# Altium project scalar_network_analyzer.PrjPcb
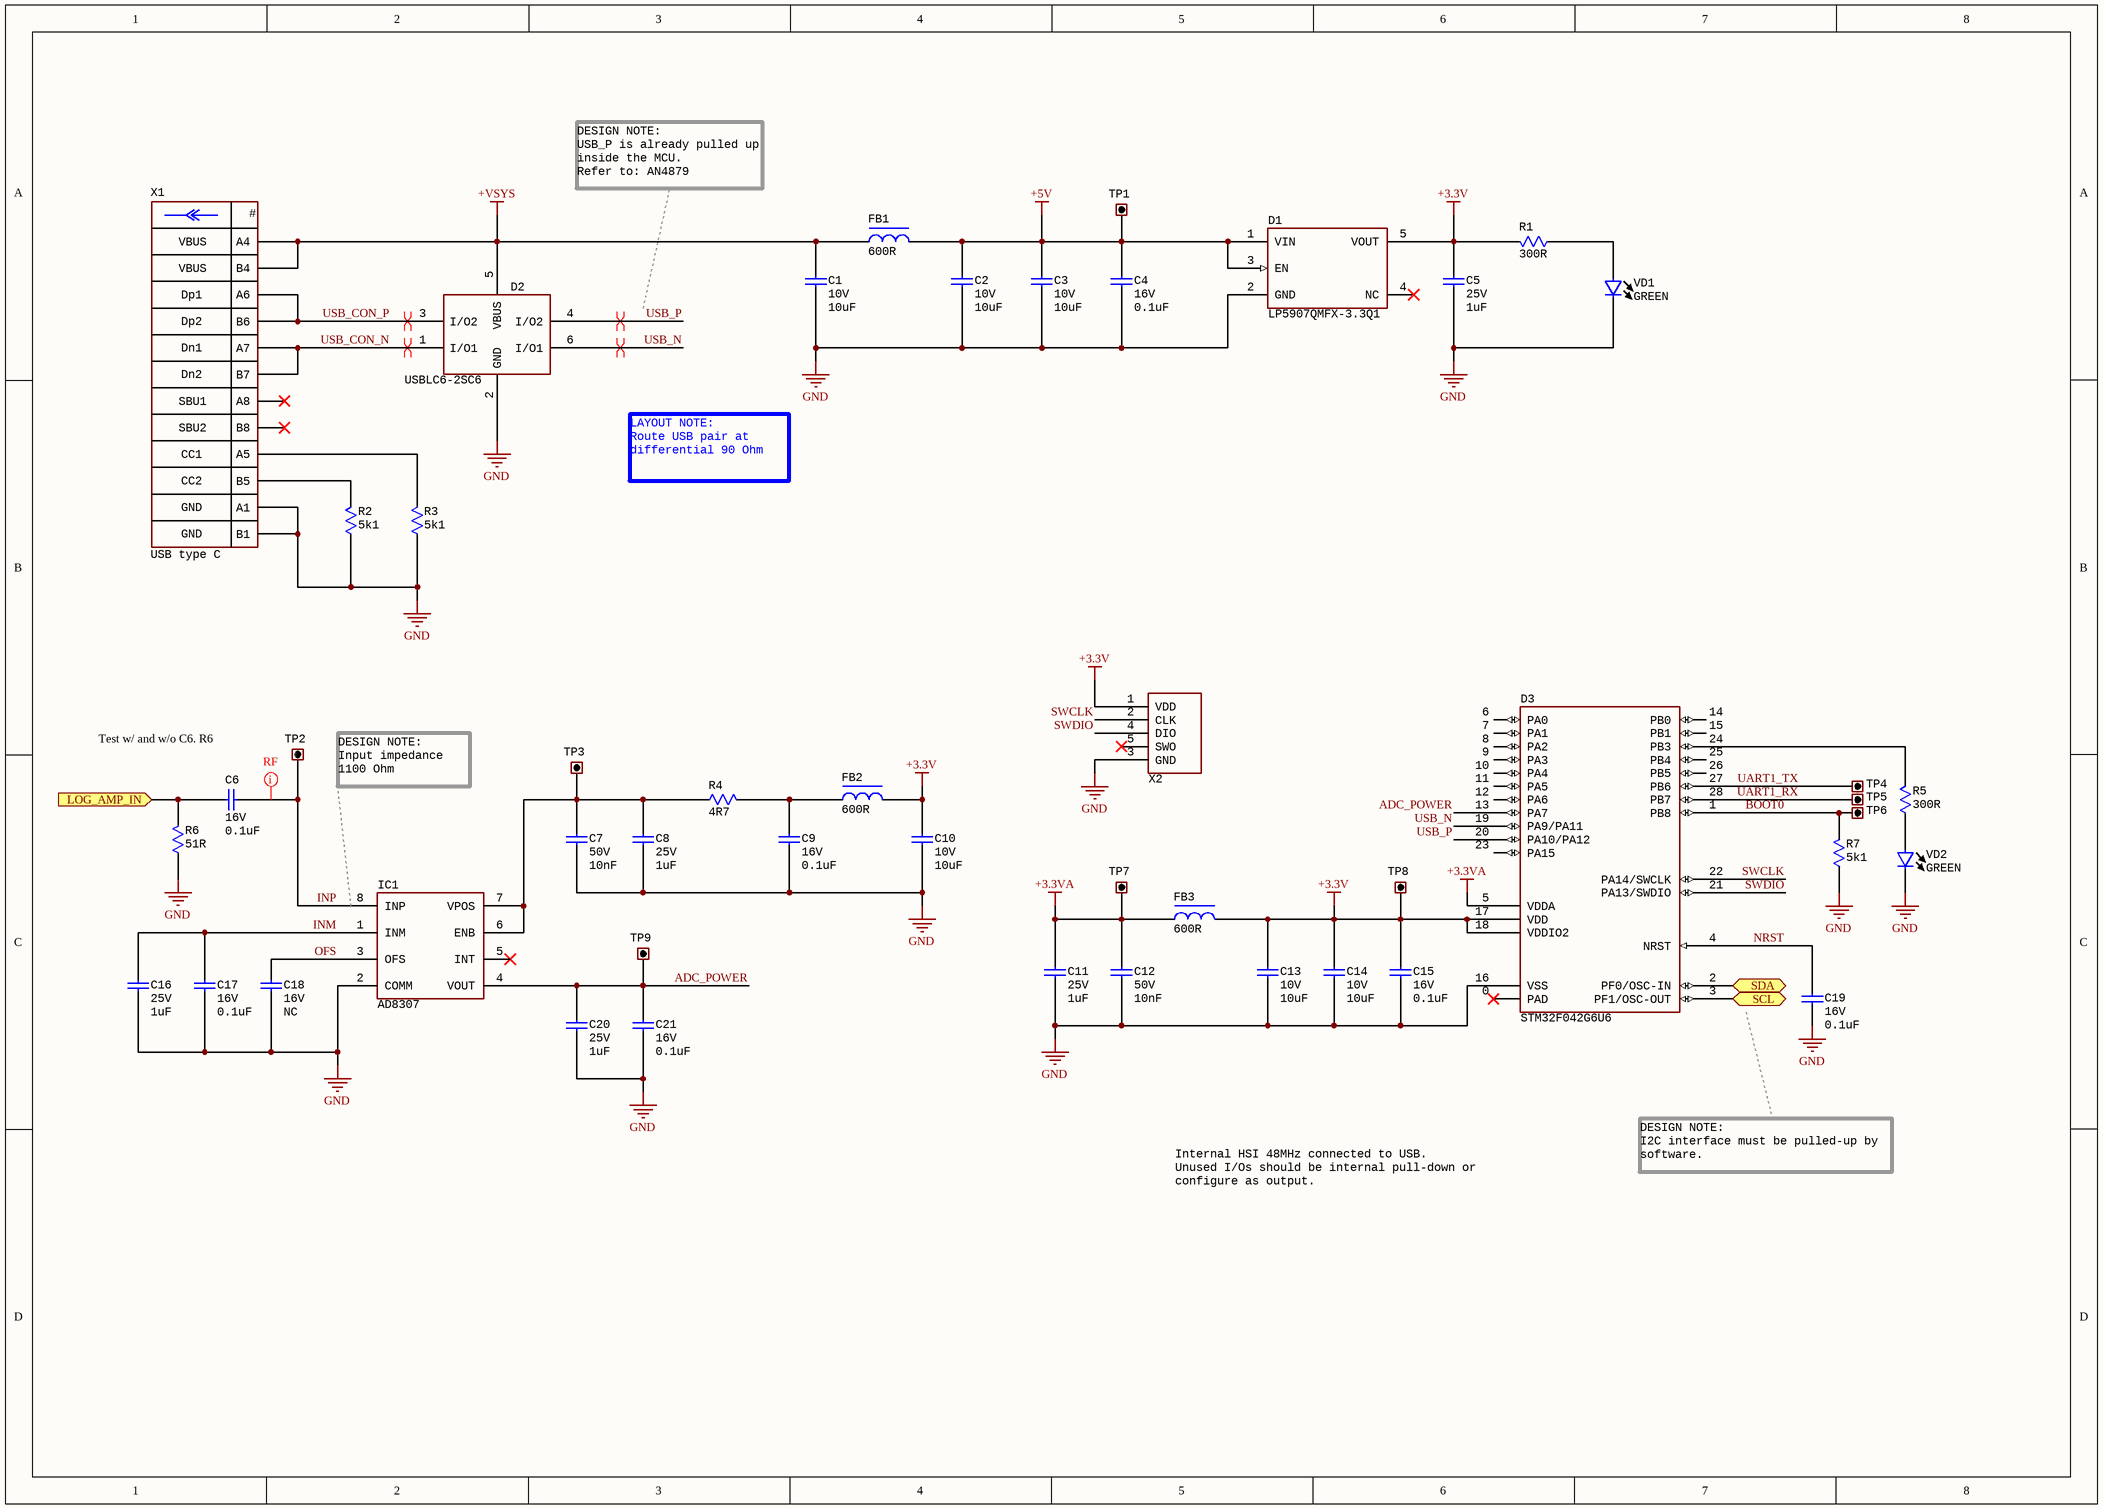
[diagram p0: 01_digital_back_end.SchDoc]
2 sheets, 93 parts. Net scope: flat (ports and power ports of the same name join across sheets).
Board file: sna_pcb.PcbDoc
Sheets:
  01_digital_back_end.SchDoc
  02_rf_front_end.SchDoc

## Sheet 01_digital_back_end.SchDoc
size A3; SheetNumber: 1; SheetTotal: 2

### Parts
C1  value 10uF  Voltage: 10V  [CAP: 0603]
C2  value 10uF  Voltage: 10V  [CAP: 0603]
C3  value 10uF  Voltage: 10V  [CAP: 0603]
C4  value 0.1uF  Voltage: 16V  [CAP: 0402]
C5  value 1uF  Voltage: 25V  [CAP: 0402]
C6  value 0.1uF  Voltage: 16V  [CAP: 0402]
C7  value 10nF  Voltage: 50V  [CAP: 0402]
C8  value 1uF  Voltage: 25V  [CAP: 0402]
C9  value 0.1uF  Voltage: 16V  [CAP: 0402]
C10  value 10uF  Voltage: 10V  [CAP: 0603]
C11  value 1uF  Voltage: 25V  [CAP: 0402]
C12  value 10nF  Voltage: 50V  [CAP: 0402]
C13  value 10uF  Voltage: 10V  [CAP: 0603]
C14  value 10uF  Voltage: 10V  [CAP: 0603]
C15  value 0.1uF  Voltage: 16V  [CAP: 0402]
C16  value 1uF  Voltage: 25V  [CAP: 0402]
C17  value 0.1uF  Voltage: 16V  [CAP: 0402]
C18  value NC  Voltage: 16V  [CAP: 0402]  (no BOM)
C19  value 0.1uF  Voltage: 16V  [CAP: 0402]
C20  value 1uF  Voltage: 25V  [CAP: 0402]
C21  value 0.1uF  Voltage: 16V  [CAP: 0402]
D1  LP5907QMFX-3.3Q1  [SOT23-5]
D2  (no value)  [SOT23-6]
D3  STM32F042G6U6  [28-QFN (4x4)]
FB1  Resistance: 600R  [IND: 0603]
FB2  Resistance: 600R  [IND: 0603]
FB3  Resistance: 600R  [IND: 0603]
IC1  AD8307  [8-SOIC]
R1  value 300R  [RES: 0603]
R2  value 5k1  [RES: 0603]
R3  value 5k1  [RES: 0603]
R4  value 4R7  [RES: 0603]
R5  value 300R  [RES: 0603]
R6  value 51R  [RES: 0603]
R7  value 5k1  [RES: 0603]
TP1  (no value)  [CON: test_point]  (no BOM)
TP2  (no value)  [CON: test_point]  (no BOM)
TP3  (no value)  [CON: test_point]  (no BOM)
TP4  (no value)  [CON: test_point]  (no BOM)
TP5  (no value)  [CON: test_point]  (no BOM)
TP6  (no value)  [CON: test_point]  (no BOM)
TP7  (no value)  [CON: test_point]  (no BOM)
TP8  (no value)  [CON: test_point]  (no BOM)
TP9  (no value)  [CON: test_point]  (no BOM)
VD1  Color: GREEN  [LED: 0603B]
VD2  Color: GREEN  [LED: 0603B]
X1  CommentText: USB type C  [CON: TYPE-C-31-M-12]
X2  (no value)  [CON: 1.27 Pogo Pin contact]  (no BOM)

### Ports
LOG_AMP_IN (in, see 02_rf_front_end[7B]), SCL (bidir, see 02_rf_front_end[5C]), SDA (bidir, see 02_rf_front_end[5C])

### Nets
+3.3V: C5.1 C10.1 C13.1 C14.1 C15.1 D1.5(VOUT) D3.17(VDD) D3.18(VDDIO2) FB2.1 FB3.1 R1.2 TP8.1 X2.1(VDD)
+3.3VA: C11.1 C12.1 D3.5(VDDA) FB3.2 TP7.1
+5V: C2.1 C3.1 C4.1 D1.1(VIN) D1.3(EN) FB1.1 TP1.1
+VSYS: C1.1 D2.5(VBUS) FB1.2 X1.A4 X1.B4
GND: C1.2 C2.2 C3.2 C4.2 C5.2 C7.2 C8.2 C9.2 C10.2 C11.2 C12.2 C13.2 C14.2 C15.2 C16.2 C17.2 C18.2 C19.2 C20.2 C21.2 D1.2(GND) D2.2(GND) D3.16(VSS) IC1.2(COMM) R2.1 R3.1 R6.1 R7.1 VD1.2 VD2.2 X1.A1 X1.B1 X2.3(GND)
ADC_POWER: C20.1 C21.1 D3.13(PA7) IC1.4(VOUT) TP9.1
BOOT0: D3.1(PB8) R7.2 TP6.1
INM: C16.1 C17.1 IC1.1(INM)
INP: C6.2 IC1.8(INP) TP2.1
NRST: C19.1 D3.4(NRST)
OFS: C18.1 IC1.3(OFS)
SWCLK: D3.22(PA14/SWCLK) X2.2(CLK)
SWDIO: D3.21(PA13/SWDIO) X2.4(DIO)
UART1_RX: D3.28(PB7) TP5.1
UART1_TX: D3.27(PB6) TP4.1
USB_CON_N: D2.1(I/O1) X1.A7 X1.B7
USB_CON_P: D2.3(I/O2) X1.A6 X1.B6
USB_N: D2.6(I/O1) D3.19(PA9/PA11)
USB_P: D2.4(I/O2) D3.20(PA10/PA12)
NetC6_1: C6.1 R6.2 ; port LOG_AMP_IN
NetC7_1: C7.1 C8.1 IC1.6(ENB) IC1.7(VPOS) R4.1 TP3.1
NetC9_1: C9.1 FB2.2 R4.2
NetD3_2: D3.2(PF0/OSC-IN) ; port SDA
NetD3_3: D3.3(PF1/OSC-OUT) ; port SCL
NetD3_24: D3.24(PB3) R5.2
NetR1_1: R1.1 VD1.1
NetR2_2: R2.2 X1.B5
NetR3_2: R3.2 X1.A5
NetR5_1: R5.1 VD2.1

Not connected (* = marked no-connect by the designer): D1 4(NC)*; D3 0(PAD)* 6(PA0) 7(PA1) 8(PA2) 9(PA3) 10(PA4) 11(PA5) 12(PA6) 14(PB0) 15(PB1) 23(PA15) 25(PB4) 26(PB5); IC1 5(INT)*; X1 A8* B8*; X2 5(SWO)*

### Layout directives
differential pair: USB_CON_N, USB_CON_P, USB_N, USB_P
net class RF: INP

### Notes on the sheet
- DESIGN NOTE:
  USB_P is already pulled up inside the MCU.
  Refer to: AN4879
- LAYOUT NOTE:
  Route USB pair at differential 90 Ohm
- Test w/ and w/o C6. R6
- (near TP2) DESIGN NOTE:
  Input impedance 1100 Ohm
- DESIGN NOTE:
  I2C interface must be pulled-up by software.
- Internal HSI 48MHz connected to USB.
  Unused I/Os should be internal pull-down or configure as output.
- (in symbol Connector_USB_Type_C) #; VBUS; Dp1; Dp2; Dn1; Dn2; SBU1; SBU2; CC1; CC2; GND

### Library data of the parts
C1-C3 C10 C13 C14 = Ceramic: Manufacturer: Samsung Electro-Mechanics; PartNumber: CL10A106KP8NNNC; ValueManufacturerPartNumber: Ceramic capacitor, 10uF, X5R, ±10%, 10V, 0603, -55...+125°C; TypeCapacitor: Ceramic capacitor; Tolerance: ±10%; TypeDielectric: X5R; Package: 0603; HelpURL: https://jlcpcb.com/partdetail/20411-CL10A106KP8NNNC/C19702; Temperature: -55...+125°C; JLCPCB Part #: C19702
C4 C6 C9 C15 C17 C19 C21 = Ceramic: Manufacturer: Samsung Electro-Mechanics; PartNumber: CL05B104KO5NNNC; ValueManufacturerPartNumber: Ceramic capacitor, 0.1uF, X7R, ±10%, 16V, 0402, -55...+125°C; TypeCapacitor: Ceramic capacitor; Tolerance: ±10%; TypeDielectric: X7R; Package: 0402; HelpURL: https://jlcpcb.com/partdetail/1877-CL05B104KO5NNNC/C1525; Temperature: -55...+125°C; JLCPCB Part #: C1525
C5 C8 C11 C16 C20 = Ceramic: Manufacturer: Samsung Electro-Mechanics; PartNumber: CL05A105KA5NQNC; ValueManufacturerPartNumber: Ceramic capacitor, 1uF, X5R, ±10%, 25V, 0402, -55...+125°C; TypeCapacitor: Ceramic capacitor; Tolerance: ±10%; TypeDielectric: X5R; Package: 0402; HelpURL: https://jlcpcb.com/partdetail/53938-CL05A105KA5NQNC/C52923; Temperature: -55...+125°C; JLCPCB Part #: C52923
C7 C12 = Ceramic: Manufacturer: Samsung Electro-Mechanics; PartNumber: CL05B103KB5NNNC; ValueManufacturerPartNumber: Ceramic capacitor, 10nF, X7R, ±10%, 50V, 0402, -55...+125°C; TypeCapacitor: Ceramic capacitor; Tolerance: ±10%; TypeDielectric: X7R; Package: 0402; HelpURL: https://jlcpcb.com/partdetail/15869-CL05B103KB5NNNC/C15195; Temperature: -55...+125°C; JLCPCB Part #: C15195
C18 = Ceramic: Manufacturer: Yageo; PartNumber: CC0201KRX7R7BB103; ValueManufacturerPartNumber: Ceramic capacitor, NC, X7R, ±10%, 16V, 0603, -55...+125°C; TypeCapacitor: Ceramic capacitor; Tolerance: ±10%; TypeDielectric: X7R; Package: 0603; HelpURL: https://www.digikey.com/product-detail/en/yageo/CC0201KRX7R7BB103/311-1404-1-ND/2833710; Temperature: -55...+125°C
D1 = LDO: ValueManufacturerPartNumber: LP5907QMFX-3.3Q1; PartNumber: LP5907QMFX-3.3Q1
D2 = USBLC6-2SC6: Manufacturer: STMicroelectronics; TypeDiode: USB protection; Current: 5A peak; VoltageDrop: 17V; RecoveryTime: Power line; Package: SOT-23-6; HelpURL: https://www.digikey.com/product-detail/en/stmicroelectronics/USBLC6-2SC6/497-5235-1-ND/1121688; ValueManufacturerPartNumber: =TypeDiode+', '+Voltage+', '+Current+', '+VoltageDrop+', '+RecoveryTime+', '+Package+', '+Temperature; Temperature: -40...+125°C; PartNumber: USBLC6-2SC6
D3 = STM32F042G6U6: Cortex-M0, 48MHz, 32KB ROM, 6KB RAM, 2.4...3.6V, QFN-28, -40...+85°C; Manufacturer: STMicroelectronics; HelpURL: https://eu.mouser.com/ProductDetail/STMicroelectronics/STM32F042K6U6?qs=4l9S5vBWkUI1HFPPlP09zA%3D%3D; Package: QFN-28; PartNumber: STM32F042G6U6; JLCPCB Part #: C961597
FB1-FB3 = Ferrite_Bead_SMD: Manufacturer: Sunlord; PartNumber: LQP03TNR10J02D; TypeInductor: Ferrite Bead; MaxCurrent: 200mA; Frequency: 100 MHz; Package: 0603; HelpURL: https://www.digikey.com/product-detail/en/murata-electronics-north-america/LQP03TNR10J02D/490-6742-1-ND/3845939; ValueManufacturerPartNumber: =TypeInductor+', '+Value+', '+Tolerance+', '+Package+', '+MaxCurrent+', '+Temperature; Temperature: -55...+125°C; JLCPCB Part #: C1002
IC1 = AD8307: Integrated Circuit; Manufacturer_Name: Analog Devices; Datasheet Link: https://www.arrow.com/en/products/ad8310arm/analog-devices; Height: 1.1mm; Manufacturer_Part_Number: AD8307; Mouser Price/Stock: https://www.mouser.com/Search/Refine.aspx?Keyword=584-AD8310ARM; Arrow Price/Stock: https://www.arrow.com/en/products/ad8310arm/analog-devices
R1 R5 = Resistor: Manufacturer: Yageo; PartNumber: RC0201JR-07100RL; ValueManufacturerPartNumber: Resistor film, 300R, ±5%, 0603, 0.05W, -55...+125°C; TypeResistor: Resistor film; Power: 0.05W; Tolerance: ±5%; Package: 0603; HelpURL: https://www.digikey.com/product-detail/en/yageo/RC0201JR-07100RL/311-100NCT-ND/1949006; Temperature: -55...+125°C; JLCPCB Part #: C23025
R2 R3 = Resistor: Manufacturer: Yageo; PartNumber: 0603WAF5101T5E; ValueManufacturerPartNumber: Resistor film, 5k1, ±5%, 0603, 0.05W, -55...+125°C; TypeResistor: Resistor film; Power: 0.05W; Tolerance: ±5%; Package: 0603; HelpURL: https://lcsc.com/product-detail/Chip-Resistor-Surface-Mount_UNI-ROYAL-Uniroyal-Elec-0603WAF5101T5E_C23186.html; Temperature: -55...+125°C; JLCPCB Part #: C23186
R4 = Resistor: Manufacturer: Yageo; PartNumber: RC0201JR-07100RL; ValueManufacturerPartNumber: Resistor film, 4R7, ±5%, 0603, 0.05W, -55...+125°C; TypeResistor: Resistor film; Power: 0.05W; Tolerance: ±5%; Package: 0603; HelpURL: https://www.digikey.com/product-detail/en/yageo/RC0201JR-07100RL/311-100NCT-ND/1949006; Temperature: -55...+125°C; JLCPCB Part #: C23164
R6 = Resistor: Manufacturer: Yageo; PartNumber: 0603WAF5101T5E; ValueManufacturerPartNumber: Resistor film, 51R, ±5%, 0603, 0.05W, -55...+125°C; TypeResistor: Resistor film; Power: 0.05W; Tolerance: ±5%; Package: 0603; HelpURL: https://lcsc.com/product-detail/Chip-Resistor-Surface-Mount_UNI-ROYAL-Uniroyal-Elec-0603WAF5101T5E_C23186.html; Temperature: -55...+125°C; JLCPCB Part #: C23197
R7 = Resistor: Manufacturer: Yageo; PartNumber: RC0201JR-07100RL; ValueManufacturerPartNumber: Resistor film, 5k1, ±5%, 0603, 0.05W, -55...+125°C; TypeResistor: Resistor film; Power: 0.05W; Tolerance: ±5%; Package: 0603; HelpURL: https://www.digikey.com/product-detail/en/yageo/RC0201JR-07100RL/311-100NCT-ND/1949006; Temperature: -55...+125°C; JLCPCB Part #: C23186
TP1-TP9 = Connector_Test_Point: Manufacturer: Keystone; ValueManufacturerPartNumber: Test point, Keystone, 5001; PartNumber: 5001; TypeConnector: Test point; HelpURL: https://www.digikey.com/product-detail/en/keystone-electronics/5001/36-5001-ND/255327
VD1 VD2 = LED_single: ValueManufacturerPartNumber: LED, Green, *, *, *, -55...+150°C; TypeDiode: LED; Manufacturer: *; Package: *; HelpURL: *; Temperature: -55...+150°C; Current: *; VoltageDrop: *; PartNumber: *; ColorParameter: Green; JLCPCB Part #: C72041
X1 = Connector_USB_Type_C: Manufacturer: Korean Hroparts; ValueManufacturerPartNumber: USB Type C, 3A; PartNumber: TYPE-C-31-M-12; CurrentMax: 3A; HelpURL: https://lcsc.com/product-detail/USB-Type-C_Korean-Hroparts-Elec-TYPE-C-31-M-12_C165948.html; TypeConnector: USB Type C
X2 = Connector SWD: SWD Interface

## Sheet 02_rf_front_end.SchDoc
size A3; SheetNumber: 2; SheetTotal: 2
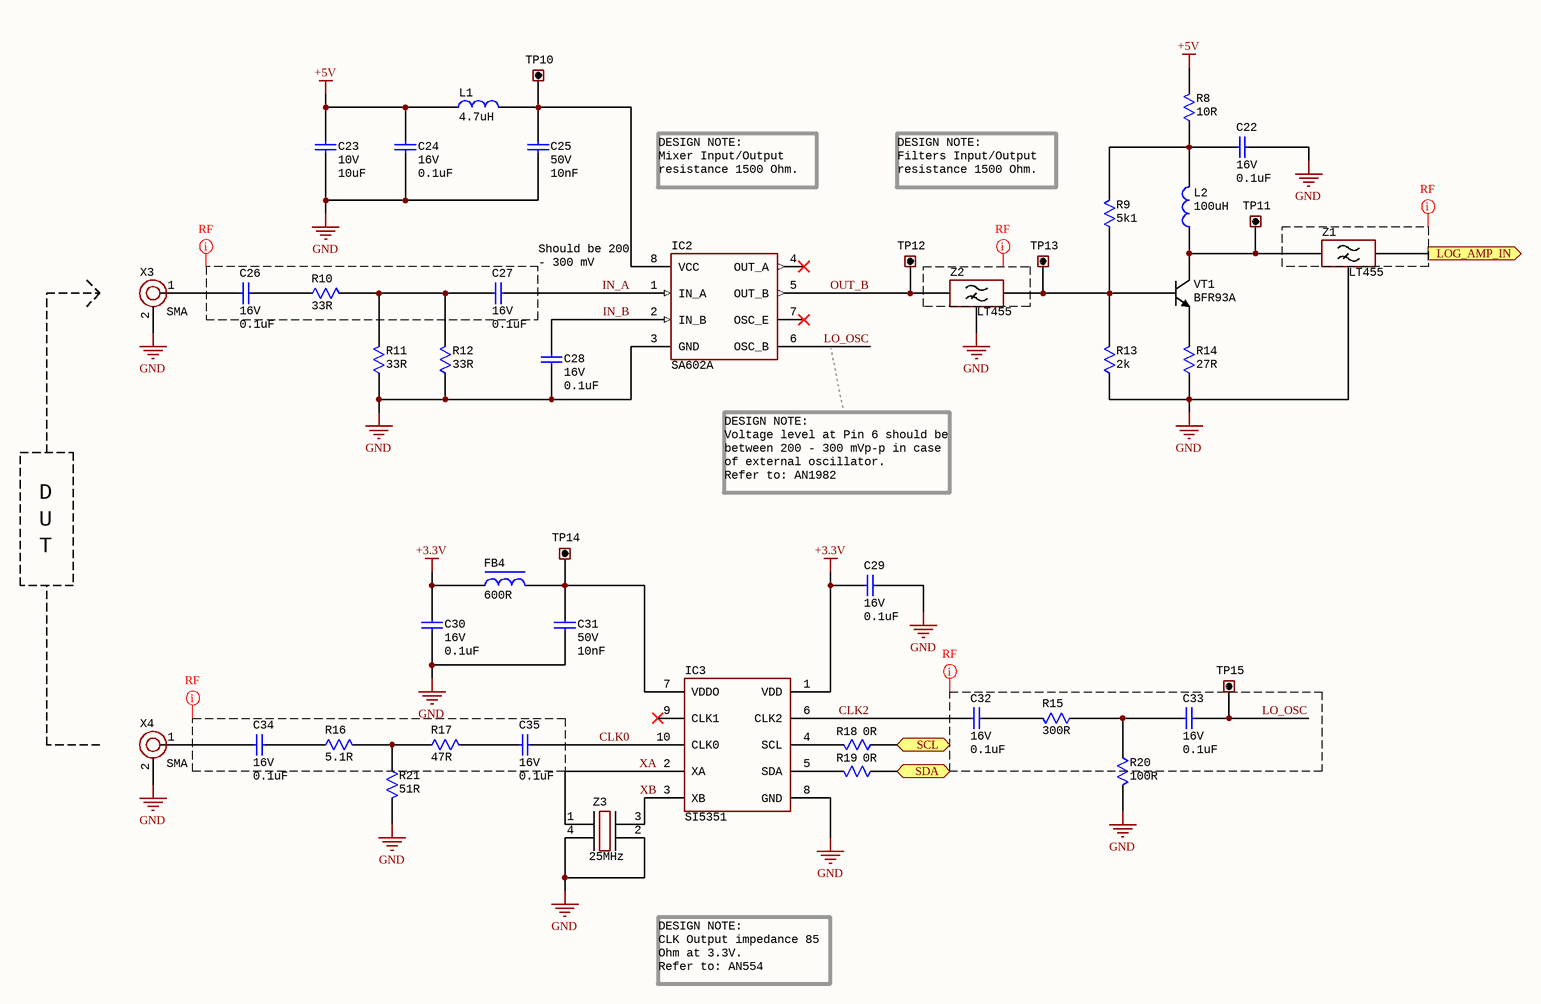
[diagram p1: 02_rf_front_end.SchDoc]

### Parts
C22  value 0.1uF  Voltage: 16V  [CAP: 0402]
C23  value 10uF  Voltage: 10V  [CAP: 0603]
C24  value 0.1uF  Voltage: 16V  [CAP: 0402]
C25  value 10nF  Voltage: 50V  [CAP: 0402]
C26  value 0.1uF  Voltage: 16V  [CAP: 0402]
C27  value 0.1uF  Voltage: 16V  [CAP: 0402]
C28  value 0.1uF  Voltage: 16V  [CAP: 0402]
C29  value 0.1uF  Voltage: 16V  [CAP: 0402]
C30  value 0.1uF  Voltage: 16V  [CAP: 0402]
C31  value 10nF  Voltage: 50V  [CAP: 0402]
C32  value 0.1uF  Voltage: 16V  [CAP: 0402]
C33  value 0.1uF  Voltage: 16V  [CAP: 0402]
C34  value 0.1uF  Voltage: 16V  [CAP: 0402]
C35  value 0.1uF  Voltage: 16V  [CAP: 0402]
FB4  Resistance: 600R  [IND: 0603]
IC2  SA602A  [8-SOIC]
IC3  SI5351  [10-MSOP]
L1  value 4.7uH  [IND: 0603]
L2  value 100uH  [IND: 0805]
R8  value 10R  [RES: 0603]
R9  value 5k1  [RES: 0603]
R10  value 33R  [RES: 0603]
R11  value 33R  [RES: 0603]
R12  value 33R  [RES: 0603]
R13  value 2k  [RES: 0603]
R14  value 27R  [RES: 0603]
R15  value 300R  [RES: 0603]
R16  value 5.1R  [RES: 0603]
R17  value 47R  [RES: 0603]
R18  value 0R  [RES: 0402]  (no BOM)
R19  value 0R  [RES: 0402]  (no BOM)
R20  value 100R  [RES: 0603]
R21  value 51R  [RES: 0603]
TP10  (no value)  [CON: test_point]  (no BOM)
TP11  (no value)  [CON: test_point]  (no BOM)
TP12  (no value)  [CON: test_point]  (no BOM)
TP13  (no value)  [CON: test_point]  (no BOM)
TP14  (no value)  [CON: test_point]  (no BOM)
TP15  (no value)  [CON: test_point]  (no BOM)
VT1  PartNumber: BFR93A  [SOT23]
X3  CommentText: SMA  [CON: SMA EDGE MOUNT]
X4  CommentText: SMA  [CON: SMA EDGE MOUNT]
Z1  (no value)  [CFUKG455]
Z2  (no value)  [CFUKG455]
Z3  Frequency: 25MHz  [OSC: 3225]

### Ports
LOG_AMP_IN (out, see 01_digital_back_end[1C]), SCL (bidir, see 01_digital_back_end[7C]), SDA (bidir, see 01_digital_back_end[7C])

### Nets
+3.3V: C29.1 C30.1 FB4.2 IC3.1(VDD)
+5V: C23.1 C24.1 L1.2 R8.2
GND: C22.2 C23.2 C24.2 C25.2 C28.1 C29.2 C30.2 C31.2 IC2.3(GND) IC3.8(GND) R11.1 R12.1 R13.1 R14.1 R20.1 R21.1 X3.2 X4.2 Z1.3(GND) Z2.3(GND) Z3.2 Z3.4
CLK0: C35.1 IC3.10(CLK0)
CLK2: C32.2 IC3.6(CLK2)
IN_A: C27.2 IC2.1(IN_A)
IN_B: C28.2 IC2.2(IN_B)
LO_OSC: C33.1 IC2.6(OSC_B) TP15.1
OUT_B: IC2.5(OUT_B) TP12.1 Z2.1(IN)
XA: IC3.2(XA) Z3.1
XB: IC3.3(XB) Z3.3
NetC6_1: Z1.2(OUT) ; port LOG_AMP_IN
NetC22_1: C22.1 L2.1 R8.1 R9.2
NetC25_1: C25.1 IC2.8(VCC) L1.1 TP10.1
NetC26_1: C26.1 X3.1
NetC26_2: C26.2 R10.1
NetC27_1: C27.1 R10.2 R11.2 R12.2
NetC31_1: C31.1 FB4.1 IC3.7(VDDO) TP14.1
NetC32_1: C32.1 R15.1
NetC33_2: C33.2 R15.2 R20.2
NetC34_1: C34.1 R16.2
NetC34_2: C34.2 X4.1
NetC35_2: C35.2 R17.1
NetD3_2: R19.1 ; port SDA
NetD3_3: R18.1 ; port SCL
NetIC3_4: IC3.4(SCL) R18.2
NetIC3_5: IC3.5(SDA) R19.2
NetL2_2: L2.2 TP11.1 VT1.3(C) Z1.1(IN)
NetR9_1: R9.1 R13.2 TP13.1 VT1.1(B) Z2.2(OUT)
NetR14_2: R14.2 VT1.2(E)
NetR16_1: R16.1 R17.2 R21.2

Not connected (* = marked no-connect by the designer): IC2 4(OUT_A)* 7(OSC_E)*; IC3 9(CLK1)*

### Layout directives
net class RF: (no net found under the mark), LO_OSC

### Notes on the sheet
- DESIGN NOTE:
  Mixer Input/Output resistance 1500 Ohm.
- DESIGN NOTE:
  Filters Input/Output resistance 1500 Ohm.
- Should be 200 - 300 mV
- D
- U
- DESIGN NOTE:
  Voltage level at Pin 6 should be between 200 - 300 mVp-p in case of external oscillator.
  Refer to: AN1982
- T
- DESIGN NOTE:
  CLK Output impedance 85 Ohm at 3.3V.
  Refer to: AN554

### Library data of the parts
C22 C24 C26-C30 C32-C35 = Ceramic: as C4 on sheet 01_digital_back_end; Package: 0402; HelpURL: https://jlcpcb.com/partdetail/1877-CL05B104KO5NNNC/C1525; Temperature: -55...+125°C; JLCPCB Part #: C1525
C23 = Ceramic: as C1 on sheet 01_digital_back_end; Package: 0603; HelpURL: https://jlcpcb.com/partdetail/20411-CL10A106KP8NNNC/C19702; Temperature: -55...+125°C; JLCPCB Part #: C19702
C25 C31 = Ceramic: as C7 on sheet 01_digital_back_end; Package: 0402; HelpURL: https://jlcpcb.com/partdetail/15869-CL05B103KB5NNNC/C15195; Temperature: -55...+125°C; JLCPCB Part #: C15195
FB4 = Ferrite_Bead_SMD: as FB1 on sheet 01_digital_back_end; Package: 0603; HelpURL: https://www.digikey.com/product-detail/en/murata-electronics-north-america/LQP03TNR10J02D/490-6742-1-ND/3845939; ValueManufacturerPartNumber: =TypeInductor+', '+Value+', '+Tolerance+', '+Package+', '+MaxCurrent+', '+Temperature; Temperature: -55...+125°C; JLCPCB Part #: C1002
IC2 = SA602A: Integrated Circuit; Manufacturer_Name: NXP; Manufacturer_Part_Number: SA602AD/01,118; Datasheet Link: http://www.nxp.com/docs/en/data-sheet/SA602A.pdf; Height: 1.75mm; Mouser Part Number: 771-SA602AD/01-T; Mouser Price/Stock: https://www.mouser.co.uk/ProductDetail/NXP-Semiconductors/SA602AD-01118?qs=LOCUfHb8d9uqq1xhBWuUZQ%3D%3D; Arrow Part Number: SA602AD/01,118; Arrow Price/Stock: https://www.arrow.com/en/products/sa602ad01118/nxp-semiconductors?region=nac
IC3 = Si5351A: Integrated Circuit; Manufacturer_Name: Silicon Labs; Manufacturer_Part_Number: Si5351A-B-GT; Datasheet Link: https://componentsearchengine.com/Datasheets/1/Si5351A-B-GT.pdf; Height: 1.1mm; Mouser Part Number: 634-SI5351A-B-GT; Mouser Price/Stock: https://www.mouser.co.uk/ProductDetail/Silicon-Labs/SI5351A-B-GT?qs=p9T7GgSe1IEO%252BMfC%2FKPFfA%3D%3D; Arrow Part Number: SI5351A-B-GT; Arrow Price/Stock: https://www.arrow.com/en/products/si5351a-b-gt/silicon-labs; JLCPCB Part #: C504891
L1 = Inductor_SMD: Manufacturer: Murata Electronics; PartNumber: LQP03TNR10J02D; ValueManufacturerPartNumber: Fixed inductor, 4.7uH, ±5%, 0201, 80mA, -55...+125°C; TypeInductor: Fixed inductor; MaxCurrent: 80mA; Tolerance: ±5%; Package: 0201; HelpURL: https://www.digikey.com/product-detail/en/murata-electronics-north-america/LQP03TNR10J02D/490-6742-1-ND/3845939; Temperature: -55...+125°C; JLCPCB Part #: C1034
L2 = Inductor_SMD: Manufacturer: Murata Electronics; PartNumber: LQP03TNR10J02D; ValueManufacturerPartNumber: Fixed inductor, 100uH, ±5%, 0201, 80mA, -55...+125°C; TypeInductor: Fixed inductor; MaxCurrent: 80mA; Tolerance: ±5%; Package: 0201; HelpURL: https://www.digikey.com/product-detail/en/murata-electronics-north-america/LQP03TNR10J02D/490-6742-1-ND/3845939; Temperature: -55...+125°C
R8 = Resistor: Manufacturer: Yageo; PartNumber: RC0201JR-07100RL; ValueManufacturerPartNumber: Resistor film, 10R, ±5%, 0603, 0.05W, -55...+125°C; TypeResistor: Resistor film; Power: 0.05W; Tolerance: ±5%; Package: 0603; HelpURL: https://www.digikey.com/product-detail/en/yageo/RC0201JR-07100RL/311-100NCT-ND/1949006; Temperature: -55...+125°C
R9 = Resistor: as R7 on sheet 01_digital_back_end; Package: 0603; HelpURL: https://www.digikey.com/product-detail/en/yageo/RC0201JR-07100RL/311-100NCT-ND/1949006; Temperature: -55...+125°C; JLCPCB Part #: C23186
R10-R12 = Resistor: Manufacturer: Yageo; PartNumber: RC0201JR-07100RL; ValueManufacturerPartNumber: Resistor film, 33R, ±5%, 0603, 0.05W, -55...+125°C; TypeResistor: Resistor film; Power: 0.05W; Tolerance: ±5%; Package: 0603; HelpURL: https://www.digikey.com/product-detail/en/yageo/RC0201JR-07100RL/311-100NCT-ND/1949006; Temperature: -55...+125°C; JLCPCB Part #: C23140
R13 = Resistor: Manufacturer: Yageo; PartNumber: RC0201JR-07100RL; ValueManufacturerPartNumber: Resistor film, 2k, ±5%, 0603, 0.05W, -55...+125°C; TypeResistor: Resistor film; Power: 0.05W; Tolerance: ±5%; Package: 0603; HelpURL: https://www.digikey.com/product-detail/en/yageo/RC0201JR-07100RL/311-100NCT-ND/1949006; Temperature: -55...+125°C; JLCPCB Part #: C22975
R14 = Resistor: Manufacturer: Yageo; PartNumber: RC0201JR-07100RL; ValueManufacturerPartNumber: Resistor film, 27R, ±5%, 0603, 0.05W, -55...+125°C; TypeResistor: Resistor film; Power: 0.05W; Tolerance: ±5%; Package: 0603; HelpURL: https://www.digikey.com/product-detail/en/yageo/RC0201JR-07100RL/311-100NCT-ND/1949006; Temperature: -55...+125°C; JLCPCB Part #: C25190
R15 = Resistor: as R1 on sheet 01_digital_back_end; Package: 0603; HelpURL: https://www.digikey.com/product-detail/en/yageo/RC0201JR-07100RL/311-100NCT-ND/1949006; Temperature: -55...+125°C; JLCPCB Part #: C23025
R16 = Resistor: Manufacturer: Yageo; PartNumber: RC0201JR-07100RL; ValueManufacturerPartNumber: Resistor film, 5.1R, ±5%, 0603, 0.05W, -55...+125°C; TypeResistor: Resistor film; Power: 0.05W; Tolerance: ±5%; Package: 0603; HelpURL: https://www.digikey.com/product-detail/en/yageo/RC0201JR-07100RL/311-100NCT-ND/1949006; Temperature: -55...+125°C; JLCPCB Part #: C25197
R17 = Resistor: Manufacturer: Yageo; PartNumber: RC0201JR-07100RL; ValueManufacturerPartNumber: Resistor film, 47R, ±5%, 0603, 0.05W, -55...+125°C; TypeResistor: Resistor film; Power: 0.05W; Tolerance: ±5%; Package: 0603; HelpURL: https://www.digikey.com/product-detail/en/yageo/RC0201JR-07100RL/311-100NCT-ND/1949006; Temperature: -55...+125°C; JLCPCB Part #: C23182
R18 R19 = Resistor: Manufacturer: Yageo; PartNumber: RC0201JR-07100RL; ValueManufacturerPartNumber: Resistor film, 0R, ±5%, 0603, 0.05W, -55...+125°C; TypeResistor: Resistor film; Power: 0.05W; Tolerance: ±5%; Package: 0603; HelpURL: https://www.digikey.com/product-detail/en/yageo/RC0201JR-07100RL/311-100NCT-ND/1949006; Temperature: -55...+125°C
R20 = Resistor: Manufacturer: Yageo; PartNumber: RC0201JR-07100RL; ValueManufacturerPartNumber: Resistor film, 100R, ±5%, 0603, 0.05W, -55...+125°C; TypeResistor: Resistor film; Power: 0.05W; Tolerance: ±5%; Package: 0603; HelpURL: https://www.digikey.com/product-detail/en/yageo/RC0201JR-07100RL/311-100NCT-ND/1949006; Temperature: -55...+125°C; JLCPCB Part #: C22775
R21 = Resistor: Manufacturer: Yageo; PartNumber: RC0201JR-07100RL; ValueManufacturerPartNumber: Resistor film, 51R, ±5%, 0603, 0.05W, -55...+125°C; TypeResistor: Resistor film; Power: 0.05W; Tolerance: ±5%; Package: 0603; HelpURL: https://www.digikey.com/product-detail/en/yageo/RC0201JR-07100RL/311-100NCT-ND/1949006; Temperature: -55...+125°C; JLCPCB Part #: C23197
TP10-TP15 = Connector_Test_Point: as TP1 on sheet 01_digital_back_end; HelpURL: https://www.digikey.com/product-detail/en/keystone-electronics/5001/36-5001-ND/255327
VT1 = BJT_NPN_132: Manufacturer: ON Semiconductor; ValueManufacturerPartNumber: NPN transistor, 45V, 100mA, 100MHz, 300mW, 0.6V, 420, SOT-23, -55...+125°C; TypeTransistor: NPN transistor; VoltageCE: 45V; CurrentCE: 100mA; VoltageSaturation: 0.6V; Frequency: 100MHz; CurrentGain: 420; MaxPower: 300mW; Package: SOT-23; HelpURL: https://www.digikey.com/product-detail/en/on-semiconductor/BC847CLT1G/BC847CLT1GOSCT-ND/917836; Temperature: -55...+125°C
X3 X4 = Connector_SMA: Manufacturer: TE Connectivity; ValueManufacturerPartNumber: Connector SMA, 50 Ohm, 3GHz; PartNumber: 5-1814832-1; TypeConnector: Connector SMA; Frequency: 3GHz; Impedance: 50 Ohm; HelpURL: https://www.digikey.com/product-detail/en/te-connectivity-amp-connectors/5-1814832-1/A97594-ND/1755982
Z1 Z2 = LT455: PartNumber: LT455
Z3 = Oscilator: Manufacturer: Yangxing Tech; PartNumber: X322525MOB4SI; ValueManufacturerPartNumber: Oscilator, 25MHz, HCMOS, ±50ppm, case 3225, -20...+70°C; LoadCapacitance: HCMOS; Tolerance: ±50ppm; Package: case 3225; HelpURL: https://jlcpcb.com/partdetail/YangxingTech-X322525MOB4SI/C9006; Temperature: -20...+70°C; TypeOscilator: Oscilator; JLCPCB Part #: C9006

## Nets that join several sheets
+3.3V: 01_digital_back_end (13 pins), 02_rf_front_end (C29.1 C30.1 FB4.2 IC3.1)
+5V: 01_digital_back_end (7 pins), 02_rf_front_end (C23.1 C24.1 L1.2 R8.2)
GND: 01_digital_back_end (33 pins), 02_rf_front_end (22 pins)
NetC6_1: 01_digital_back_end (C6.1 R6.2), 02_rf_front_end (Z1.2)
NetD3_2: 01_digital_back_end (D3.2), 02_rf_front_end (R19.1)
NetD3_3: 01_digital_back_end (D3.3), 02_rf_front_end (R18.1)